# EAGLE design Shruthi-Analog-CEM3379-v05 (EAGLE 5.09)
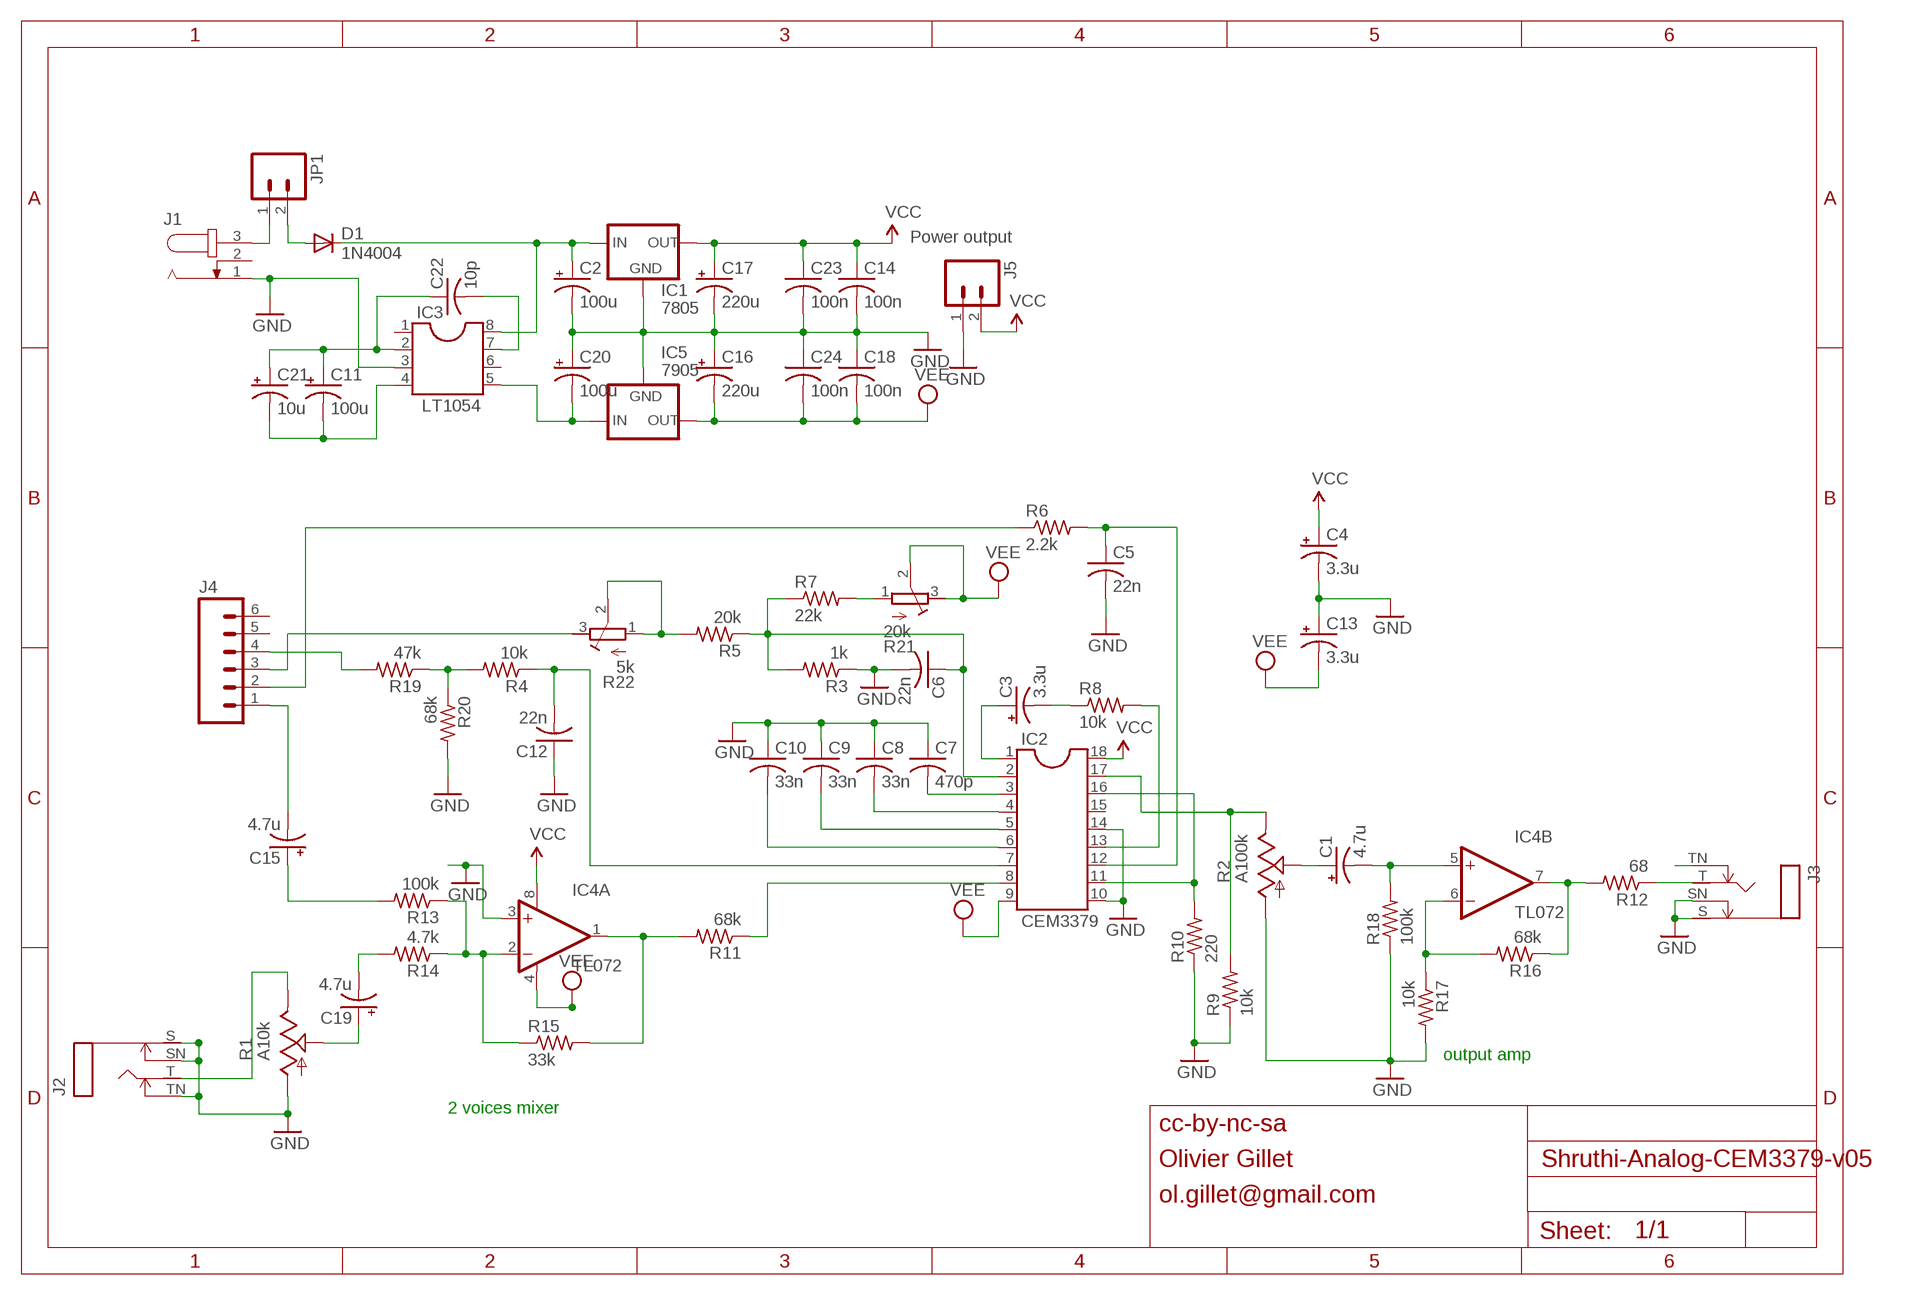
[diagram p0: schematic, sheet 1]

## Parts
C1  4.7u  CPOL-USE2.5-6  [E2,5-6]
C2  100u  CPOL-USE2.5-7  [E2,5-7]
C3  3.3u  CPOL-USE2.5-6  [E2,5-6]
C4  3.3u  CPOL-USE2.5-6  [E2,5-6]
C5  22n  C-US050-025X075  [C050-025X075]
C6  22n  C-US050-025X075  [C050-025X075]
C7  470p  C-US050-024X044  [C050-024X044]
C8  33n  C-US050-025X075  [C050-025X075]
C9  33n  C-US050-025X075  [C050-025X075]
C10  33n  C-US050-025X075  [C050-025X075]
C11  100u  CPOL-USE2.5-6  [E2,5-6]
C12  22n  C-US050-025X075  [C050-025X075]
C13  3.3u  CPOL-USE2.5-6  [E2,5-6]
C14  100n  C-US025-024X044  [C025-024X044]
C15  4.7u  CPOL-USE2.5-6  [E2,5-6]
C16  220u  CPOL-USE5-10.5  [E5-10,5]
C17  220u  CPOL-USE5-10.5  [E5-10,5]
C18  100n  C-US025-024X044  [C025-024X044]
C19  4.7u  CPOL-USE2.5-6  [E2,5-6]
C20  100u  CPOL-USE2.5-7  [E2,5-7]
C21  10u  CPOL-USE2.5-5  [E2,5-5]
C22  10p  C-US025-024X044  [C025-024X044]
C23  100n  C-US025-024X044  [C025-024X044]
C24  100n  C-US025-024X044  [C025-024X044]
D1  1N4004  [DO41-10]
IC1  7805  78XXS  [78XXS]
IC2  CEM3379  CEM3379SOCKET  [SOCKET18]
IC3  LT1054  DIL8  [DIL08]
IC4  TL072  OPA2132P  [DIL08]
IC5  7905  79XXS  [79XXS]
J1  JACK-PLUG  [SPC4078_LARGER_HOLES]
J2  MONOSWS  [NMJ4HC-S]
J3  MONOSWS  [NMJ4HC-S]
J4  M06SIP  [1X06]
J5  M02PTH  [1X02]
JP1  M02  [1X02_LONGPADS]
R1  A10k  POT_USCABLED  [CABLE_POT_6MM]
R2  A100k  POT_USCABLED  [CABLE_POT_6MM]
R3  1k  R-US_0204/7  [0204/7]
R4  10k  R-US_0204/7  [0204/7]
R5  20k  R-US_0204/7  [0204/7]
R6  2.2k  R-US_0204/7  [0204/7]
R7  22k  R-US_0204/7  [0204/7]
R8  10k  R-US_0204/7  [0204/7]
R9  10k  R-US_0204/7  [0204/7]
R10  220  R-US_0204/7  [0204/7]
R11  68k  R-US_0204/7  [0204/7]
R12  68  R-US_0204/7  [0204/7]
R13  100k  R-US_0204/7  [0204/7]
R14  4.7k  R-US_0204/7  [0204/7]
R15  33k  R-US_0204/7  [0204/7]
R16  68k  R-US_0204/7  [0204/7]
R17  10k  R-US_0204/7  [0204/7]
R18  100k  R-US_0204/7  [0204/7]
R19  47k  R-US_0204/7  [0204/7]
R20  68k  R-US_0204/7  [0204/7]
R21  20k  R-TRIMM3296W  [RTRIM3296W]
R22  5k  R-TRIMM3296W  [RTRIM3296W]

## Nets
AUDIOIN: IC4.1(A:OUT) R11.2 R15.2
GND: C2.- C4.- C5.2 C6.2 C7.1 C8.1 C9.1 C10.1 C12.1 C13.+ C14.2 C16.+ C17.- C18.1 C20.+ C23.2 C24.1 IC1.GND IC2.10(GND) IC2.14(PANCV) IC3.3 IC4.3(A:+IN) IC5.GND J1.1 J2.S J2.SN J2.TN J3.S J3.SN J5.1 R1.A R2.A R3.1 R9.1 R10.1 R17.2 R18.1 R20.2
N$2: C20.- IC3.5 IC5.IN
N$3: J1.3 JP1.1
N$4: D1.A JP1.2
N$5: C11.- C21.- IC3.4
N$6: IC2.8(VCFIN) R11.1
N$7: C15.+ R13.2
N$8: C15.- J4.1
N$9: J4.3 R22.3(A)
N$14: C5.1 IC2.12(GAINCV) R6.2
N$16: IC4.7(B:OUT) R12.2 R16.1
N$17: J3.TN
N$18: J4.2 R6.1
N$19: R4.2 R19.1 R20.1
N$20: J3.T R12.1
N$21: C2.+ D1.C IC1.IN IC3.8
N$22: C19.+ R1.S
N$23: IC4.2(A:-IN) R13.1 R14.1 R15.1
N$24: C19.- R14.2
N$25: C1.- IC4.5(B:+IN) R18.2
N$26: C7.2 IC2.3(CD)
N$27: C8.2 IC2.4(CC)
N$28: C22.2 IC3.7
N$29: C9.2 IC2.5(CB)
N$30: IC2.17(CHB) R2.E R9.2
N$31: C10.2 IC2.6(CA)
N$32: C11.+ C21.+ C22.1 IC3.2
N$33: C12.2 IC2.7(RESONANCECV) R4.1
N$34: J4.4 R19.2
N$35: IC2.13(VCAIN) R8.2
N$36: C3.- R8.1
N$37: R7.2 R21.1(E)
N$38: IC2.11(VCAOUT) IC2.16(PANIN) R10.2
N$39: C3.+ IC2.1(VCFOUT)
N$41: J2.T R1.E
N$42: R5.2 R22.1(E) R22.2(S)
N$43: C6.1 IC2.2(FREQUENCYCV) R3.2 R5.1 R7.1
N$44: C1.+ R2.S
N$45: IC4.6(B:-IN) R16.2 R17.1
VCC: C4.+ C14.1 C17.+ C23.1 IC1.OUT IC2.18(VCC) IC4.8(A:V+) J5.2
VEE: C13.- C16.- C18.2 C24.2 IC2.9(VEE) IC4.4(A:V-) IC5.OUT R21.2(S) R21.3(A)
Unconnected: IC2.15(CHAOUT) IC3.1 IC3.6 J1.2 J4.5 J4.6

## Notes on the sheet
- Power output
- output amp
- 2 voices mixer
- cc-by-nc-sa
- Olivier Gillet
- ol.gillet@gmail.com

## Library data of the parts
C1-C4 C11 C13 C15-C17 C19-C21 = rcl:CPOL-US: POLARIZED CAPACITOR, American symbol
C5-C10 C12 C14 C18 C22-C24 = rcl:C-US: CAPACITOR, American symbol
D1 = diode:1N4004: DIODE general purpose rectifier, 1 A
IC1 = v-reg:78XXS: VOLTAGE REGULATOR
IC2 = cem:CEM3379: Voltage Controlled Signal Processor VCF+VCA+panner
IC3 = ic-package:DIL8: Dual In Line / Socket
IC4 = burr-brown:OPA2132: High Speed FET-Input Operational Amplifiers< Product Folder:OPA2132
IC5 = v-reg:79XXS: VOLTAGE REGULATOR
J1 = con-jack2:JACK-PLUG: DC POWER JACK Power Jack, DC, Right Angle, Through Hole, Rated 5A at 16VDC, PC Terminals Distributor: Farnell (www.Farnell.de) Drawing: 84N1161.pdf / 84N1162.pdf Manufacturer: SPC Technology (www.spctechnology.com) Type: SPC4077 / SPC 4078
J2 J3 = gm-jacks:MONOSW
J4 = SparkFun:M06: Header 6 Standard 6-pin 0.1" header. Use with straight break away headers (SKU : PRT-00116), right angle break away headers (PRT-00553), swiss pins (PRT-00743), machine pins (PRT-00117), and female headers (PRT-00115). Molex polarized connector foot print use with SKU : PRT-08094 with associated crimp pins and housings. NOTES ON THE VARIANTS LOCK and LOCK_LONGPADS... This footprint was designed to help hold the alignment of a through-hole component (i.e. 6-pin header) while soldering it into place. You may notice that each hole has been shifted either up or down by 0.005 of an inch from it's more standard position (which is a perfectly straight line). This slight alteration caused the pins (the squares in the middle) to touch the edges of the holes. Because they are alternating, it causes a "brace" to hold the component in place. 0.005 has proven to be the perfect amount of "off-center" position when using our standard breakaway headers. Although looks a little odd when you look at the bare footprint, once you have a header in there, the alteration is very hard to notice. Also, if you push a header all the way into place, it is covered up entirely on the bottom side. This idea of altering the position of holes to aid alignment will be further integrated into the Sparkfun Library for other footprints. It can help hold any component with 3 or more connection pins.
J5 JP1 = SparkFun:M02: Header 2 Standard 2-pin 0.1" header. Use with straight break away headers (SKU : PRT-00116), right angle break away headers (PRT-00553), swiss pins (PRT-00743), machine pins (PRT-00117), and female headers (PRT-00115). Molex polarized connector foot print use with SKU : PRT-08233 with associated crimp pins and housings.
R1 R2 = pot-cable:POT_US
R3-R20 = resistor:R-US_: RESISTOR, American symbol
R21 R22 = rcl:R-TRIMM: Trimm resistor

## Board
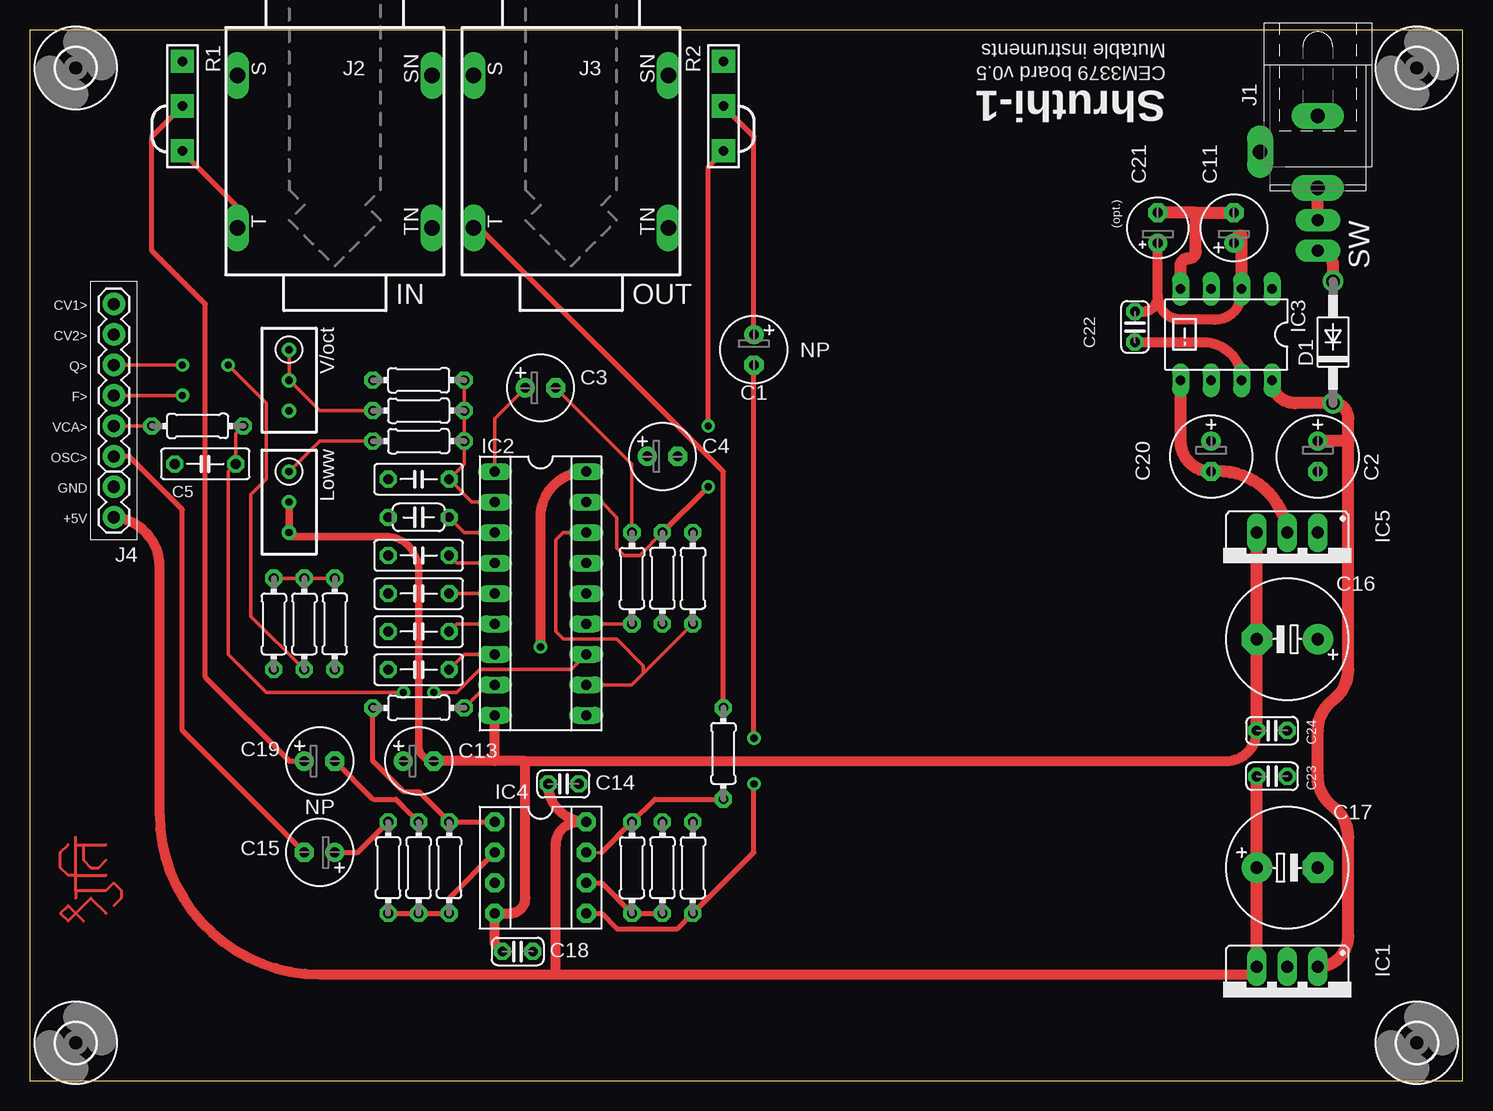
[diagram p1: board, top side]
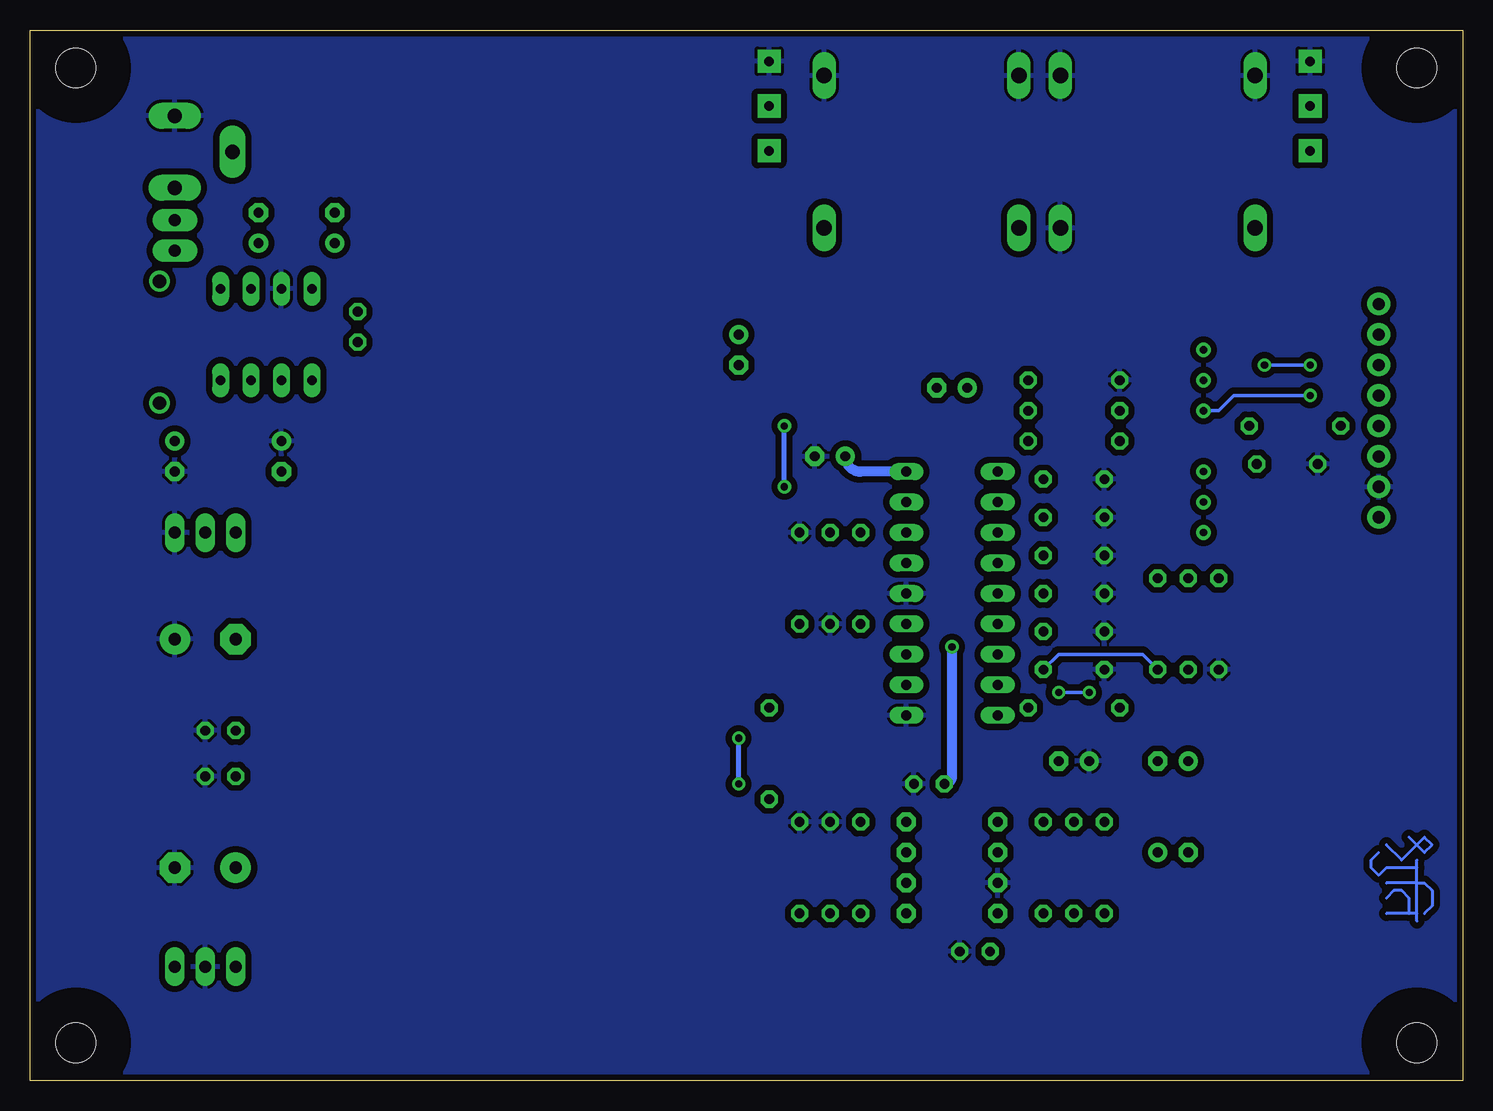
[diagram p2: board, bottom side, seen from below]

Size 119.38 x 87.62 mm. Coordinates in mm from the lower left corner, seen from the top.
Outline: 0,0 119.38,0 119.38,87.62 0,87.62 0,0
Copper layers (1*16): Top 0.035mm / dielectric 1.5mm / Bottom 0.035mm
Design rules "SparkFun_10mil": minimum track width 10mil, minimum drill 20mil, track to track 10mil, track to pad 10mil, pad to pad 10mil, via to via 10mil, smd to smd 10mil, copper to edge 10mil, drill to drill 10mil, minimum pad ring 12mil, minimum via ring 10mil, stop-mask expansion 4mil, vias tented up to drill 25mil, thermal gap 10mil

### Footprints (pad centres in the part's own frame; a part is rotated, then mirrored left to right if it is on the bottom)
E2,5-6 = drill 0.813 pad 1.6 round: + -1.27,0 | drill 0.813 pad 1.6 octagon: - 1.27,0
E2,5-7 = drill 0.813 pad 1.6 round: + -1.27,0 | drill 0.813 pad 1.6 octagon: - 1.27,0
C050-025X075 = drill 0.813 octagon: 1 -2.54,0; 2 2.54,0
C050-024X044 = drill 0.813 octagon: 1 -2.54,0; 2 2.54,0
C025-024X044 = drill 0.813 octagon: 1 -1.27,0; 2 1.27,0
E5-10,5 = drill 1.016 pad 2.54 round: + -2.54,0 | drill 1.016 pad 2.54 octagon: - 2.54,0
E2,5-5 = drill 0.813 pad 1.6 round: + -1.27,0 | drill 0.813 pad 1.6 octagon: - 1.27,0
DO41-10 = drill 1.118 round: A 5.08,0; C -5.08,0
78XXS = drill 1.016 long: GND 0,-2.54; IN -2.54,-2.54; OUT 2.54,-2.54
SOCKET18 = drill 0.813 long: 1 -10.16,-3.81; 2 -7.62,-3.81; 3 -5.08,-3.81; 4 -2.54,-3.81; 5 0,-3.81; 6 2.54,-3.81; 7 5.08,-3.81; 8 7.62,-3.81; 9 10.16,-3.81; 10 10.16,3.81; 11 7.62,3.81; 12 5.08,3.81; 13 2.54,3.81; 14 0,3.81; 15 -2.54,3.81; 16 -5.08,3.81; 17 -7.62,3.81; 18 -10.16,3.81
DIL08 = drill 0.813 long: 1 -3.81,-3.81; 2 -1.27,-3.81; 3 1.27,-3.81; 4 3.81,-3.81; 5 3.81,3.81; 6 1.27,3.81; 7 -1.27,3.81; 8 -3.81,3.81
DIL08' = drill 0.813 pad 1.6 octagon: 1 -3.81,-3.81; 2 -1.27,-3.81; 3 1.27,-3.81; 4 3.81,-3.81; 5 3.81,3.81; 6 1.27,3.81; 7 -1.27,3.81; 8 -3.81,3.81
79XXS = drill 1.016 long: GND -2.54,-2.54; IN 0,-2.54; OUT 2.54,-2.54
SPC4078_LARGER_HOLES = drill 1.2 pad 2.184 long: 1 -3,0; 2 0,-4.8; 3 3,0
NMJ4HC-S = drill 1.3 long: S 5.08,8.115; SN 5.08,-8.115; T -7.62,8.115; TN -7.62,-8.115
1X06 = drill 1.016 pad 1.88 round: 1 0,0; 2 2.54,0; 3 5.08,0; 4 7.62,0; 5 10.16,0; 6 12.7,0
1X02 = drill 1.016 pad 1.88 round: 1 0,0; 2 2.54,0
1X02_LONGPADS = drill 1.016 pad 1.88 long: 1 0,0; 2 2.54,0
CABLE_POT_6MM = drill 0.8 pad 1.93 square: A -3.73,0; E 3.73,0; S 0,0
0204/7 = drill 0.813 octagon: 1 -3.81,0; 2 3.81,0
RTRIM3296W = drill 0.61 round: 1 0,-2.54; 2 0,0; 3 0,2.54
3,3 = hole 3.3: 0,0

### Placement (x,y rotation side)
C1  60.33,60.96 270 top
C2  107.31,52.07 270 top
C3  42.55,57.79 0 top
C4  52.7,52.07 0 top
C5  14.61,51.44 180 top
C6  32.38,50.16 180 top
C7  32.38,46.99 0 top
C8  32.38,43.82 0 top
C9  32.38,40.64 0 top
C10  32.38,37.47 0 top
C11  100.33,71.12 90 top
C12  32.38,34.29 0 top
C13  32.38,26.67 0 top
C14  44.45,24.76 0 top
C15  24.13,19.05 180 top
C16  104.78,36.83 180 top
C17  104.78,17.78 0 top
C18  40.64,10.79 180 top
C19  24.13,26.67 0 top
C20  98.42,52.07 270 top
C21  93.98,71.12 90 top
C22  92.08,62.87 270 top
C23  103.5,25.4 0 top
C24  103.5,29.21 180 top
D1  108.58,61.59 90 top
IC1  104.78,6.98 180 top
IC2  42.55,40.64 270 top
IC3  99.69,62.23 180 top
IC4  TL072  [DIL08']  42.55,17.78 270 top
IC5  104.78,43.18 180 top
J1  107.31,77.47 270 top
J2  25.4,78.74 90 top
J3  45.09,78.74 90 top
J4  6.99,52.07 90 top
J5  6.99,49.53 270 top
JP1  107.31,71.75 270 top
R1  12.7,81.28 270 top
R2  57.78,81.28 270 top
R3  32.38,58.42 0 top
R4  25.4,38.1 90 top
R5  32.38,55.88 180 top
R6  13.97,54.61 0 top
R7  32.38,53.34 180 top
R8  50.16,41.91 270 top
R9  52.7,41.91 90 top
R10  55.24,41.91 270 top
R11  32.38,31.11 180 top
R12  57.78,27.3 270 top
R13  29.84,17.78 90 top
R14  32.38,17.78 90 top
R15  34.93,17.78 90 top
R16  50.16,17.78 270 top
R17  52.7,17.78 90 top
R18  55.24,17.78 270 top
R19  22.86,38.1 270 top
R20  20.32,38.1 270 top
R21  21.59,48.26 180 top
R22  21.59,58.42 180 top
U$1  [3,3]  3.81,84.45 0 top
U$2  [3,3]  115.57,84.45 0 top
U$5  [3,3]  3.81,3.17 0 top
U$6  [3,3]  115.57,3.17 0 top
U$7  [SARASWATI]  74.93,87 180 top

### Tracks (layer width: path | path; a pad name or v marks a point on that pad's centre or on a via)
AUDIOIN
  Top 0.406: IC4.1 R15.2 32.38,24.13 31.11,24.13 28.57,26.67 R11.2
GND
  pour Bottom (isolate 0.508): 0.64,87 0.64,0.64 118.75,0.64 118.75,87
N$2
  Top 1.016: IC5.IN arc90 C20.- arc-90 95.89,53.34 IC3.5
N$3
  Top 1.016: JP1.1 J1.3
N$4
  Top 1.016: JP1.2 arc-90 108.58,67.95 D1.A
N$5
  Top 1.016: 97.16,72.39 C21.- | 97.16,72.39 C11.- | IC3.4 95.89,67.95 arc-90 96.52,68.58 arc90 97.16,69.22 97.16,72.39
N$6
  Top 0.305: R11.1 38.1,33.02 IC2.8
N$7
  Top 0.406: C15.+ 27.3,19.05 R13.2
N$8
  Top 0.406: J4.1 8.26,52.07 12.7,47.62 12.7,29.21 C15.-
N$9  (via drill 0.6)
  Top 0.305: J4.3 v12.7,57.15
  Bottom 0.305: v12.7,57.15 19.05,57.15 20.32,55.88 R22.3
N$14  (via drill 0.6)
  Top 0.305: IC2.12 45.09,34.29 37.47,34.29 35.56,32.38 v33.66,32.38 | v31.11,32.38 19.68,32.38 16.51,35.56 16.51,50.8 C5.1 17.14,53.98 R6.2
  Bottom 0.305: v31.11,32.38 v33.66,32.38
N$15
  Bottom 0.254: 6.35,19.68 5.08,18.41 3.18,20.32 2.54,19.68 3.18,19.05 4.45,20.32
N$16
  Top 0.254: IC4.7 47.62,19.05
  Top 0.406: 47.62,19.05 R16.1 52.07,23.49 R12.2
N$18
  Top 0.305: J4.2 R6.1
N$19
  Top 0.305: R20.1 R19.1 R4.2
N$20
  Top 0.406: R12.1 57.78,50.8 37.47,71.12 J3.T
N$21
  Top 1.016: IC3.8 arc90 105.41,56.52 D1.C arc-90 109.86,55.25 109.86,53.34 | 109.86,53.34 109.86,34.29 arc-53 108.58,31.75 arc53 107.31,29.21 107.31,25.4 arc53 108.58,22.86 arc-53 109.86,20.32 109.86,12.07 arc-90 IC1.IN | 109.86,53.34 C2.+
N$22
  Top 0.406: C19.+ 21.59,26.67 14.61,33.66 14.61,64.77 10.16,69.22 10.16,78.74 R1.S
N$23
  Top 0.406: IC4.2 34.93,15.24 R15.1 R14.1 R13.1
N$24
  Top 0.406: R14.2 31.11,22.86 30.48,23.49 28.57,23.49 C19.-
N$25  (via drill 0.6)
  Top 0.406: IC4.5 47.62,13.97 48.89,12.7 53.98,12.7 R18.2 60.33,19.05 v60.33,24.76 | v60.33,28.57 C1.-
  Bottom 0.406: v60.33,24.76 v60.33,28.57
N$26
  Top 0.305: C7.2 36.2,45.72 IC2.3
N$27
  Top 0.305: C8.2 35.56,43.18 IC2.4
N$28
  Top 0.813: IC3.7 arc90 97.79,61.59 C22.2
N$29
  Top 0.305: C9.2 IC2.5
N$30  (via drill 0.6)
  Top 0.305: 57.78,77.47 R2.E | IC2.17 47.62,48.26 48.89,46.99 48.89,44.45 49.53,43.82 50.8,43.82 R9.2
  Top 0.406: R9.2 v56.52,49.53 | v56.52,54.61 56.52,76.2 57.78,77.47
  Bottom 0.406: v56.52,49.53 v56.52,54.61
N$31
  Top 0.305: C10.2 35.56,38.1 IC2.6
N$32
  Top 0.813: 93.98,65.41 C21.+ | 93.98,65.41 arc90 95.89,63.5 98.42,63.5 arc106 IC3.2 | C22.1 92.71,64.14 arc90 93.98,65.41
  Top 1.016: C11.+ arc-90 100.97,70.48 IC3.2
N$33
  Top 0.305: C12.2 36.2,35.56 IC2.7
  Bottom 0.305: R4.1 26.67,35.56 33.66,35.56 C12.2
N$34  (via drill 0.6)
  Top 0.305: v12.7,59.69 J4.4 | v16.51,59.69 19.68,56.52 19.68,50.16 18.41,48.9 18.41,38.73 R19.2
  Bottom 0.305: v16.51,59.69 v12.7,59.69
N$35
  Top 0.305: IC2.13 R8.2
N$36
  Top 0.305: C3.- 50.16,51.44 R8.1
N$37
  Top 0.305: R21.1 24.13,53.34 R7.2
N$38
  Top 0.305: 51.12,33.97 50.16,33.02 IC2.11 | 51.12,33.97 R10.2 | IC2.16 44.45,45.72 43.81,45.09 43.81,37.47 44.45,36.83 48.89,36.83 51.12,34.61 51.12,33.97
N$39
  Top 0.305: IC2.1 38.73,55.25 C3.+
N$41
  Top 0.406: J2.T 17.14,71.26 17.14,73.03 12.7,77.47 R1.E
N$42
  Top 0.305: R22.1 R22.2 24.13,55.88 R5.2
N$43
  Top 0.305: R3.2 R5.1 R7.1 36.2,51.44 C6.1 36.83,48.26 IC2.2
N$44
  Top 0.406: C1.+ 60.33,78.74 R2.S
N$45
  Top 0.406: IC4.6 47.62,16.51 R16.2 R17.1
N$52
  Bottom 0.254: 3.81,17.78 3.81,18.41 | 3.81,16.51 3.81,17.78 | 3.81,13.97 3.81,16.51 | 3.81,13.34 3.81,13.97 | 4.45,13.97 6.35,13.97 | 3.81,13.97 4.45,13.97 | 4.45,13.97 4.45,15.24 5.08,15.88 5.71,15.88 6.35,15.24 | 3.81,17.78 6.35,17.78 6.99,17.14 7.62,17.78 7.62,18.41 6.99,19.05 | 3.81,16.51 6.35,16.51 | 3.81,16.51 3.18,16.51 2.54,15.88 2.54,14.61 3.18,13.97
N$53
  Top 0.254: 6.35,13.97 5.08,15.24 3.18,13.34 2.54,13.97 3.18,14.61 4.45,13.34
N$54
  Top 0.254: 3.81,15.88 3.81,15.24 | 3.81,15.88 3.81,17.14 | 3.81,17.14 3.81,19.68 | 3.81,19.68 3.81,20.32 | 4.45,19.68 6.35,19.68 | 3.81,19.68 4.45,19.68 | 4.45,19.68 4.45,18.41 5.08,17.78 5.71,17.78 6.35,18.41 | 3.81,15.88 6.35,15.88 6.99,16.51 7.62,15.88 7.62,15.24 6.99,14.61 | 3.81,17.14 6.35,17.14 | 3.81,17.14 3.18,17.14 2.54,17.78 2.54,19.05 3.18,19.68
VCC  (via drill 0.6)
  Top 0.813: C14.1 arc90 IC4.8 45.72,21.59 arc90 43.81,19.68 43.81,8.89 | IC2.18 arc90 42.55,46.99 v42.55,36.2 | 43.81,8.89 24.13,8.89 arc-90 10.79,22.22 10.79,42.55 arc90 J5.2 | 43.81,8.89 101.6,8.89 arc90 IC1.OUT
  Top 1.016: IC1.OUT C17.+ C23.1
  Bottom 0.813: v42.55,36.2 42.55,25.4 arc90 C14.1 | IC2.18 50.16,50.8 arc90 C4.+
VEE
  Top 0.61: C13.- arc-90 32.38,27.94 32.38,42.23 arc90 29.84,45.4 21.59,45.4 R21.3 R21.2
  Top 0.813: C18.2 38.73,11.43 IC4.4 40.01,13.97 arc90 41.27,15.24 41.27,26.67 | 41.27,26.67 38.73,26.67 | 38.73,26.67 C13.- | 38.73,26.67 IC2.9 | 41.27,26.67 99.69,26.67 arc90 C24.2
  Top 1.016: C24.2 C16.- IC5.OUT

### Text on the board
tPlace: Mutable instruments | CV1> | CV2> | Q> | F> | VCA> | OSC> | GND | +5V
tNames: CEM3379 board v0.5 | Shruthi-1 | SW | (opt.) | IN | OUT | V/oct | NP | Loww | NP